# EAGLE design PCB (EAGLE 9.6.2)
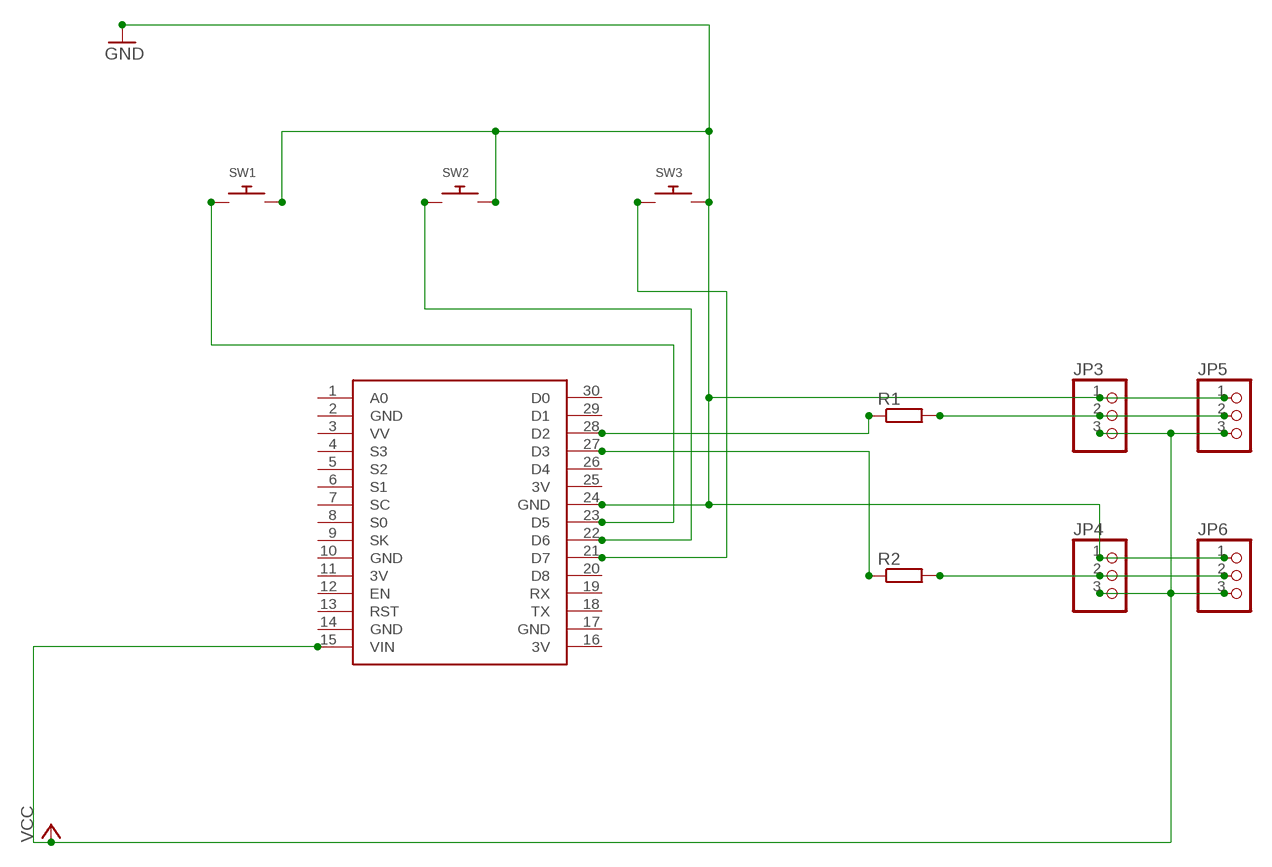
[diagram p0: schematic, sheet 1]

## Parts
JP3  PINHD-1X3  [1X03]
JP4  PINHD-1X3  [1X03]
JP5  PINHD-1X3  [1X03]
JP6  PINHD-1X3  [1X03]
R1  R-EU_0204/5  [0204/5]
R2  R-EU_0204/5  [0204/5]
SW1  SWITCH_PUSHBUTTONEVQ-PE  [TACT_PANA-EVQ]
SW2  SWITCH_PUSHBUTTONEVQ-PE  [TACT_PANA-EVQ]
SW3  SWITCH_PUSHBUTTONEVQ-PE  [TACT_PANA-EVQ]
U$1  NODEMCU  [NODEMCU]

## Nets
GND [GND]: JP3.1 JP4.1 JP5.1 JP6.1 SW1.P$2 SW2.P$2 SW3.P$2 U$1.24(GND)
N$15: SW1.P$1 U$1.23(D5)
N$22: SW2.P$1 U$1.22(D6)
N$27: R2.1 U$1.27(D3)
N$28: R1.1 U$1.28(D2)
N$35: SW3.P$1 U$1.21(D7)
N$39: JP4.2 JP6.2 R2.2
N$40: JP3.2 JP5.2 R1.2
VCC [VCC]: JP3.3 JP4.3 JP5.3 JP6.3 U$1.15(VIN)
Unconnected: U$1.1(A0) U$1.3(VV) U$1.4(S3) U$1.5(S2) U$1.6(S1) U$1.7(SC) U$1.8(S0) U$1.9(SK) U$1.12(EN) U$1.13(RST) U$1.18(TX) U$1.19(RX) U$1.20(D8) U$1.26(D4) U$1.29(D1) U$1.30(D0)

## Power pins joined to a net without a drawn wire
3V: U$1.11(3V) U$1.16(3V) U$1.25(3V)
GND: U$1.2(GND) U$1.10(GND) U$1.14(GND) U$1.17(GND)

## Library data of the parts
JP3-JP6 = adafruit:PINHD-1X3: PIN HEADER
R1 R2 = resistor:R-EU_: RESISTOR, European symbol
SW1-SW3 = adafruit:SWITCH_PUSHBUTTON: Buttons SOFTTOUCHSMD_SJ - Soft touch temporary push button (Super Junk Akihabara) Compatible with SKPMANE010 [Mouser: 688-SKPMAN] C&K_KSS = Digikey: KSS221GLFS
U$1 = nodemcu:NODEMCU

## Net classes
0 default: width 0.508 mm
1 GND: width 0.762 mm
2 VCC: width 0.762 mm

## Board
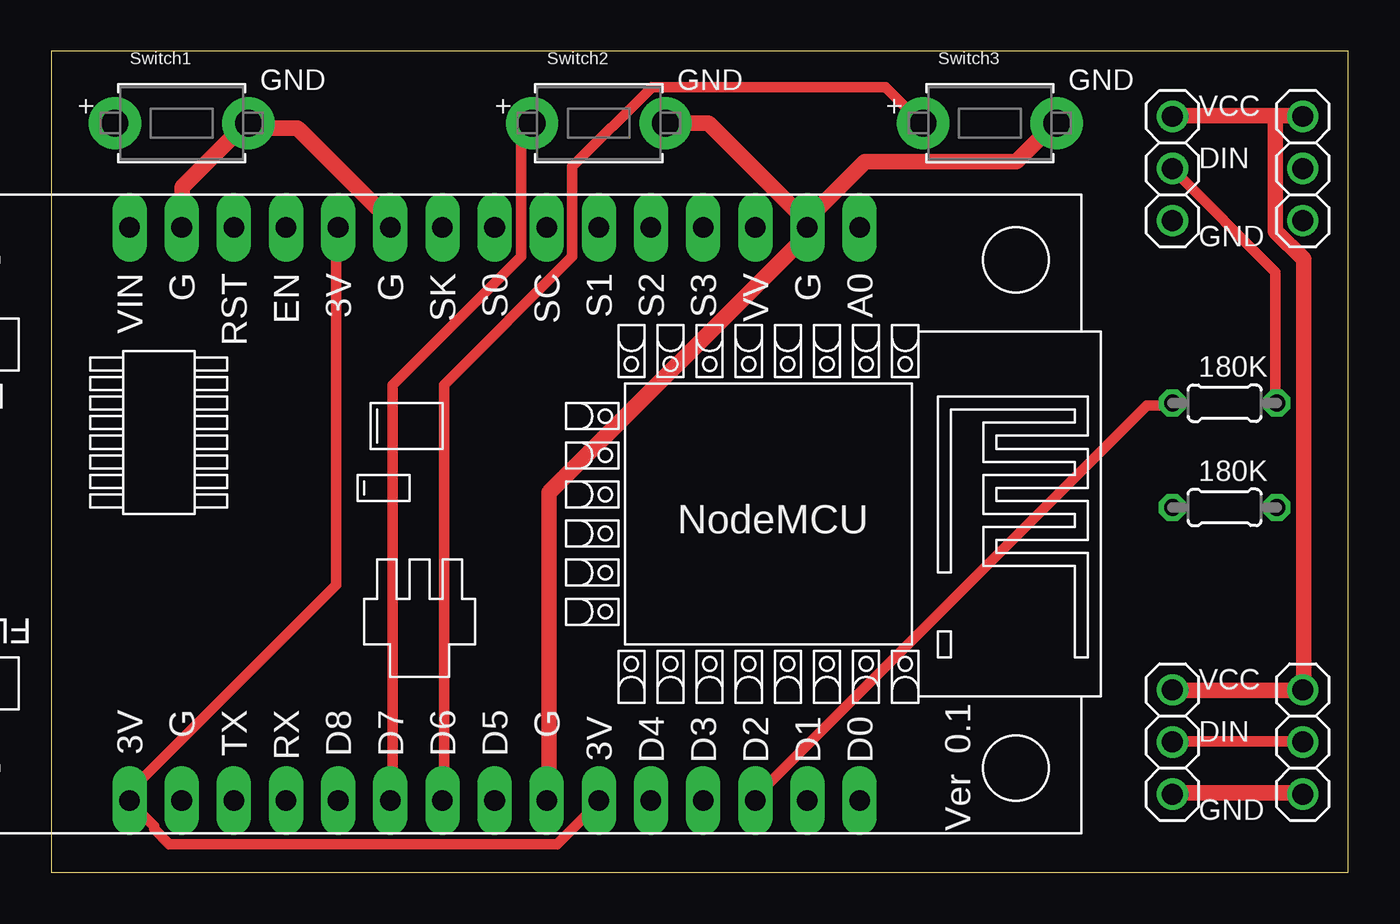
[diagram p1: board, top side]
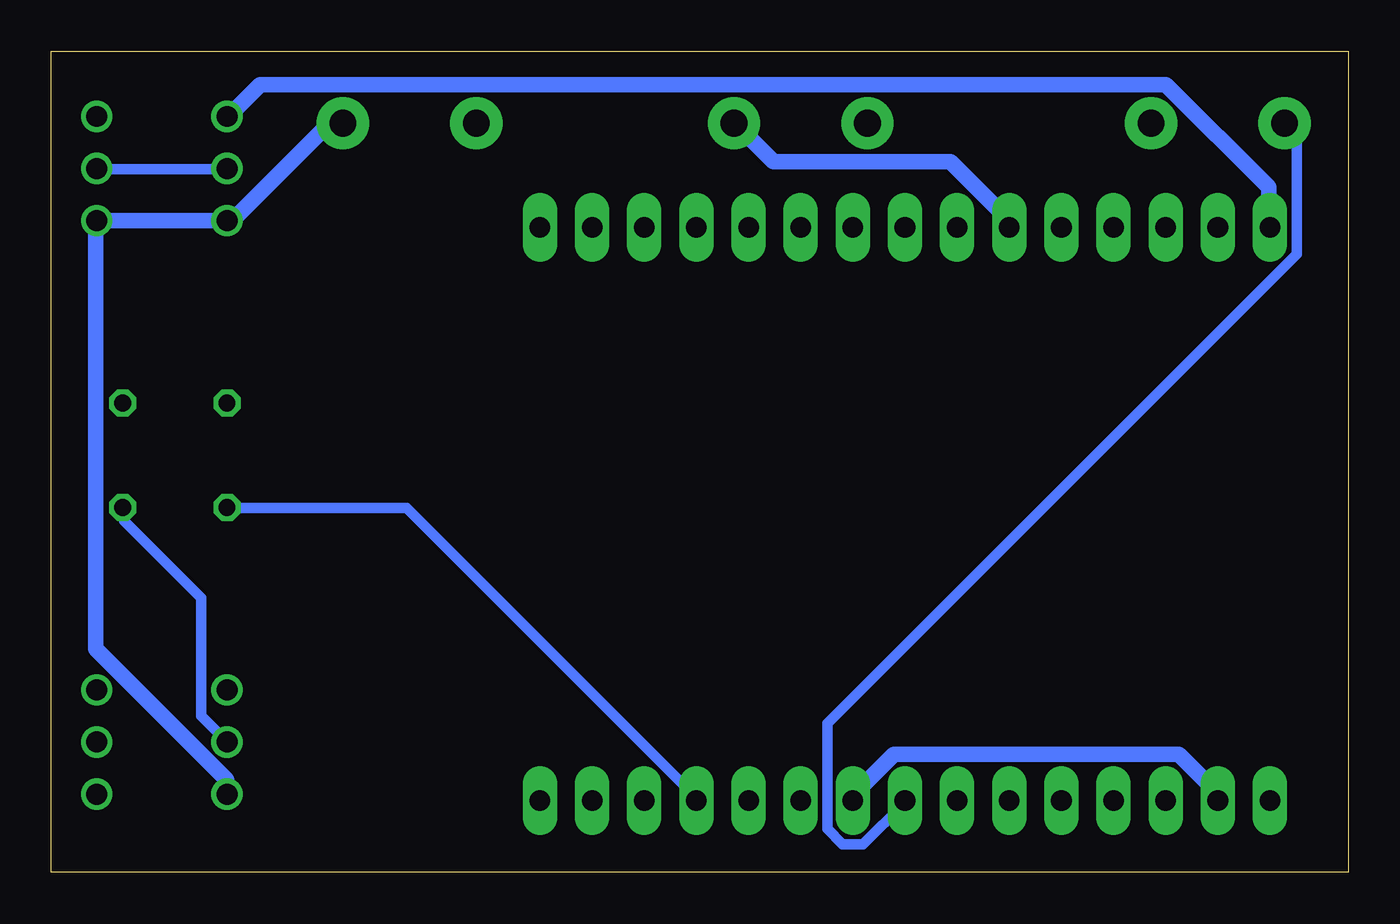
[diagram p2: board, bottom side, seen from below]

Size 63.17 x 40 mm. Coordinates in mm from the lower left corner, seen from the top.
Outline: 0,0 63.17,0 63.17,40 0,40 0,0
Copper layers (1*16): Top 0.035mm / dielectric 1.5mm / Bottom 0.035mm
Design rules "default": minimum track width 6mil, minimum drill 0.35mm, track to track 6mil, track to pad 6mil, pad to pad 6mil, via to via 6mil, smd to smd 6mil, copper to edge 40mil, drill to drill 6mil, minimum pad ring 10mil, minimum via ring 8mil, stop-mask expansion 4mil, vias tented up to drill 0mil, thermal gap 10mil

### Footprints (pad centres in the part's own frame; a part is rotated, then mirrored left to right if it is on the bottom)
1X03 = drill 1.016: 1 -2.54,0; 2 0,0; 3 2.54,0
0204/5 = drill 0.813 octagon: 1 -2.54,0; 2 2.54,0
TACT_PANA-EVQ = drill 1.3 pad 2.54: P$1 -3.25,0; P$2 3.25,0
NODEMCU = drill 1 pad 1.676 long: 1 -13.97,17.78; 2 -13.97,15.24; 3 -13.97,12.7; 4 -13.97,10.16; 5 -13.97,7.62; 6 -13.97,5.08; 7 -13.97,2.54; 8 -13.97,0; 9 -13.97,-2.54; 10 -13.97,-5.08; 11 -13.97,-7.62; 12 -13.97,-10.16; 13 -13.97,-12.7; 14 -13.97,-15.24; 15 -13.97,-17.78; 16 13.97,-17.78; 17 13.97,-15.24; 18 13.97,-12.7; 19 13.97,-10.16; 20 13.97,-7.62; 21 13.97,-5.08; 22 13.97,-2.54; 23 13.97,0; 24 13.97,2.54; 25 13.97,5.08; 26 13.97,7.62; 27 13.97,10.16; 28 13.97,12.7; 29 13.97,15.24; 30 13.97,17.78

### Placement (x,y rotation side)
JP3  54.61,34.29 90 top
JP4  60.96,6.35 90 top
JP5  60.96,34.29 90 top
JP6  54.61,6.35 90 top
R1  57.15,22.86 0 top
R2  57.15,17.78 0 top
SW1  6.35,36.5 0 top
SW2  45.72,36.5 0 top
SW3  26.67,36.5 0 top
U$1  21.59,17.46 270 top

### Tracks (layer width: path | path; a pad name or v marks a point on that pad's centre or on a via)
3V
  Top 0.508: U$1.25 26.62,3.38 24.62,1.38 5.75,1.38 5,2.12 5,2.25 3.88,3.38 U$1.16 4,3.62 4,4.12 13.88,14 13.88,31.38 U$1.11
GND
  Top 0.762: U$1.14 6.38,31.5 6.38,33.38 9.5,36.5 SW1.P$2 9.88,36.25 12,36.25 16.5,31.75 16.5,31.5 U$1.10 | SW3.P$2 32,36.5 36.75,31.75 36.75,31.5 U$1.2 | JP6.1 54.62,3.88 60.88,3.88 JP4.1 | U$1.2 37,32 39.62,34.62 47,34.62 48.88,36.5 SW2.P$2 | U$1.24 24.25,3.5 24.25,18.5 36.88,31.12 U$1.2
  Bottom 0.762: U$1.17 6.38,3.5 6.38,3.88 8.25,5.75 22.12,5.75 24.12,3.75 U$1.24 | SW2.P$2 49.62,36.5 54.25,31.88 JP3.1 JP5.1 61,31.38 61,10.88 54.62,4.5 54.62,3.88 JP6.1 | U$1.10 16.62,31.5 16.62,31.88 19.38,34.62 28,34.62 29.88,36.5 SW3.P$2
N$15
  Bottom 0.508: U$1.23 21.62,3.38 23.62,1.38 24.62,1.38 25.38,2.12 25.38,7.25 2.5,30.12 2.5,36 3,36.5 SW1.P$1
N$22
  Top 0.508: U$1.22 19.12,3.5 19.12,23.75 25.38,30 25.38,34.38 29.25,38.25 40.62,38.25 42.38,36.5 SW2.P$1
N$27
  Bottom 0.508: U$1.27 31.75,3.62 45.88,17.75 54.5,17.75 R2.1
N$28
  Top 0.508: R1.1 54.5,22.75 53.38,22.75 34.38,3.75 34.38,3.5 U$1.28
N$35
  Top 0.508: U$1.21 16.62,3.5 16.62,23.75 22.88,30 22.88,36 23.38,36.5 SW3.P$1
N$39
  Top 0.508: JP4.2 60.88,6.38 54.62,6.38 JP6.2
  Bottom 0.508: R2.2 59.62,17.75 59.62,17.12 55.88,13.38 55.88,7.62 54.62,6.38 JP6.2
N$40
  Top 0.508: R1.2 59.62,22.88 59.62,29.25 54.62,34.25 JP3.2
  Bottom 0.508: JP5.2 60.88,34.25 54.62,34.25 JP3.2
VCC
  Top 0.762: JP6.3 54.62,8.88 60.88,8.88 JP4.3 61,9.25 61,29.88 59.62,31.25 59.62,36.88 | 59.62,36.88 60.88,36.88 JP5.3 | 59.62,36.88 54.62,36.88 JP3.3
  Bottom 0.762: U$1.15 3.88,31.5 3.88,33.38 8.88,38.38 53,38.38 54.5,36.88 JP3.3

### Text on the board
tPlace: Switch1 | Switch2 | Switch3 | GND | GND | GND | + | + | + | VCC | DIN | GND | 180K | 180K | NodeMCU | VCC | DIN | GND